# Altium project BLDC_INDY_2024.PrjPcb
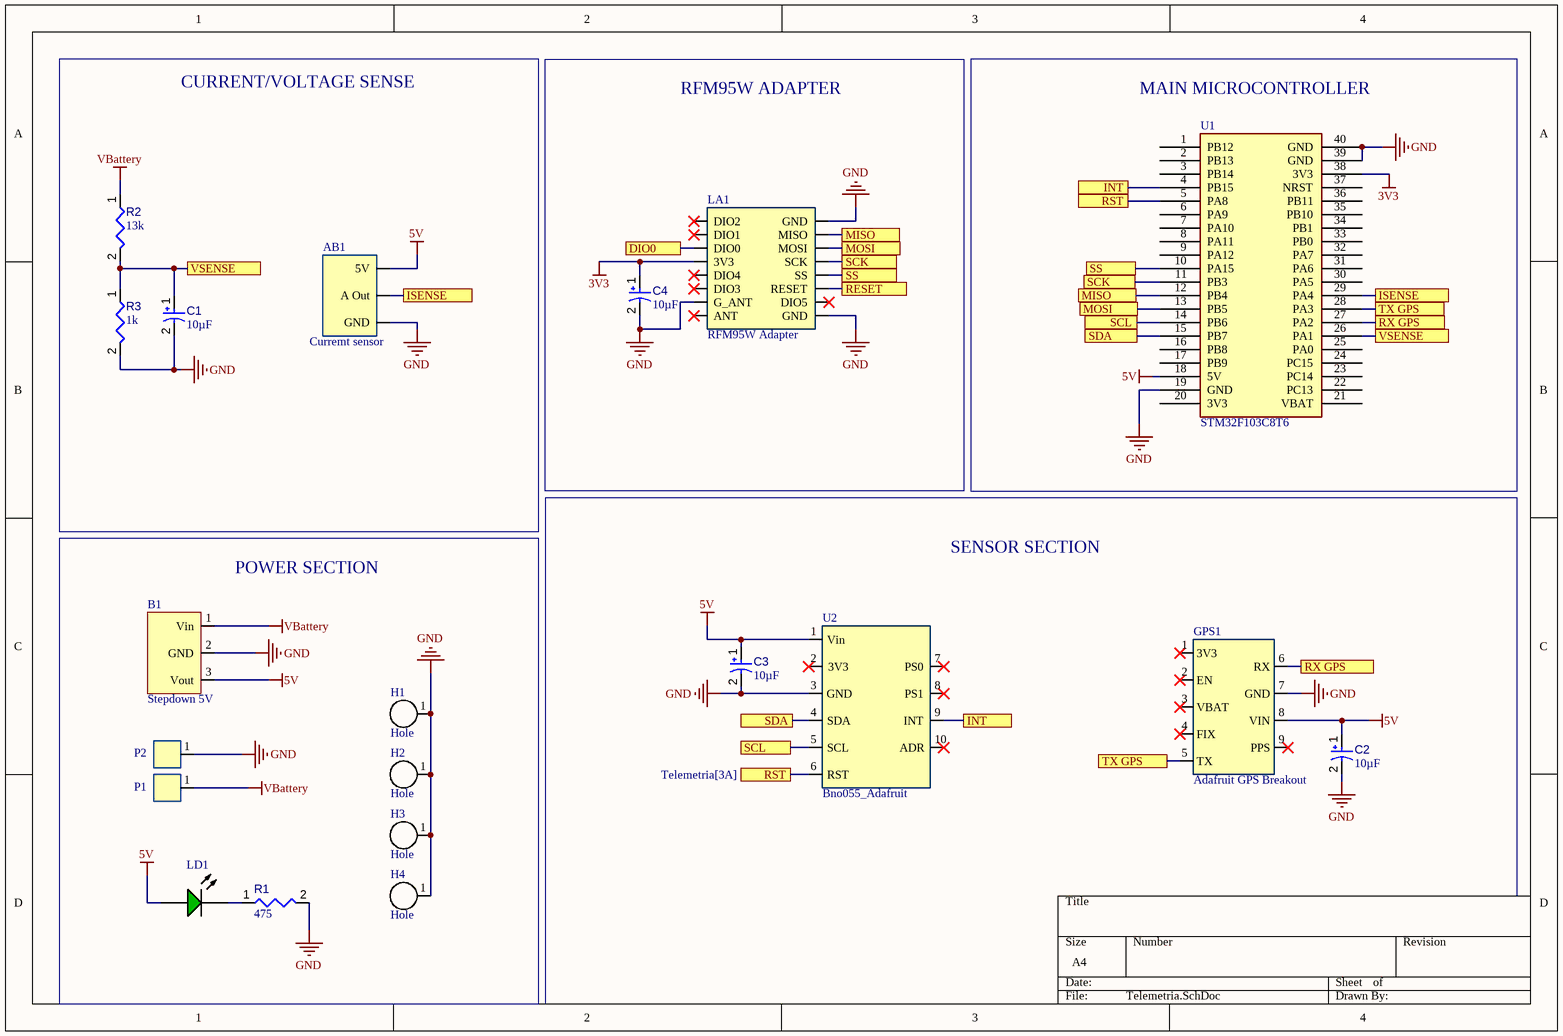
[diagram p0: Telemetria.SchDoc]
1 sheet, 20 parts. Net scope: flat (ports and power ports of the same name join across sheets).
Board file: Telemetria2.PcbDoc

## Sheet Telemetria.SchDoc: BLDC Controller
size A4; Engineer: Elyos; SheetNumber: 1; SheetTotal: 1

### Parts
AB1  Curremt sensor  [ACS712 Board]
B1  Stepdown 5V  [StepDown 5V]
C1  value 10µF  [CAPPR55-200-1100X500X1200]  (hidden comment: ECA1HM100)
C2  value 10µF  [CAPPR55-200-1100X500X1200]  (hidden comment: ECA1HM100)
C3  value 10µF  [CAPPR55-200-1100X500X1200]  (hidden comment: ECA1HM100)
C4  value 10µF  [CAPPR55-200-1100X500X1200]  (hidden comment: ECA1HM100)
GPS1  Adafruit GPS Breakout  [Adafruit GPS breakout]
H1  Hole  [Hole]
H2  Hole  [Hole]
H3  Hole  [Hole]
H4  Hole  [Hole]
LA1  RFM95W Adapter  [Lora Adapter]
LD1  304090040  [LED-2P-2.28-3MM]  (value not drawn)
P1  High power pad  [HIGH_POWER_PAD]  (value not drawn)
P2  High power pad  [HIGH_POWER_PAD]  (value not drawn)
R1  value 475  [RESA60-630X240]  (hidden comment: MFR-25FBF52-475R)
R2  value 13k  [RESA60-630X240]  (hidden comment: MFR-25FBF52-1K)
R3  value 1k  [RESA60-630X240]  (hidden comment: MFR-25FBF52-1K)
U1  STM32F103C8T6  [Stm32 BluePill]
U2  Bno055_Adafruit  [Bno055_Adafruit]

### Ports
DIO0, INT (see Telemetria[3A]), INT (see Telemetria[3C]), ISENSE (see Telemetria[2B]), ISENSE (see Telemetria[4B]), MISO (see Telemetria[3A]), MISO (see Telemetria[3B]), MOSI (see Telemetria[3A]), MOSI (see Telemetria[3B]), RESET, RST (see Telemetria[2D]), RST (see Telemetria[3A]), RX GPS (see Telemetria[4B]), RX GPS (see Telemetria[4C]), SCK (see Telemetria[3B]), SCL (see Telemetria[2C]), SCL (see Telemetria[3B]), SDA (see Telemetria[2C]), SDA (see Telemetria[3B]), SS (see Telemetria[3B]), TX GPS (see Telemetria[3C]), TX GPS (see Telemetria[4B]), VSENSE (see Telemetria[1B]), VSENSE (see Telemetria[4B])

### Nets
3V3: C4.1 LA1.4(3V3) U1.38(3V3)
5V: AB1.3(5V) B1.3(Vout) C2.1 C3.1 GPS1.8(VIN) LD1.1(A) U1.18(5V) U2.1(Vin)
GND: AB1.1(GND) B1.2(GND) C1.2 C2.2 C3.2 C4.2 GPS1.7(GND) H1.1(GND) H2.1(GND) H3.1(GND) H4.1(GND) LA1.7(G_ANT) LA1.9(GND) LA1.16(GND) P2.1(PAD) R1.2 R3.2 U1.19(GND) U1.39(GND) U1.40(GND) U2.3(GND)
VBattery: B1.1(Vin) P1.1(PAD) R2.1
NetAB1_2: AB1.2(A_Out) U1.29(PA4) ; port ISENSE
NetC1_1: C1.1 R2.2 R3.1 U1.26(PA1) ; port VSENSE
NetGPS1_5: GPS1.5(TX) U1.28(PA3) ; port TX GPS
NetGPS1_6: GPS1.6(RX) U1.27(PA2) ; port RX GPS
NetLA1_3: LA1.3(DIO0) ; port DIO0
NetLA1_10: LA1.10(MISO) U1.12(PB4) ; port MISO
NetLA1_11: LA1.11(MOSI) U1.13(PB5) ; port MOSI
NetLA1_12: LA1.12(SCK) U1.11(PB3) ; port SCK
NetLA1_13: LA1.13(SS) U1.10(PA15) ; port SS
NetLA1_14: LA1.14(RESET) ; port RESET
NetLD1_2: LD1.2(K) R1.1
NetU1_4: U1.4(PB15) U2.9(INT) ; port INT
NetU1_5: U1.5(PA8) U2.6(RST) ; port RST
NetU1_14: U1.14(PB6) U2.5(SCL) ; port SCL
NetU1_15: U1.15(PB7) U2.4(SDA) ; port SDA

Not connected (* = marked no-connect by the designer): GPS1 1(3V3)* 2(EN)* 3(VBAT)* 4(FIX)* 9(PPS)*; LA1 1(DIO2)* 2(DIO1)* 5(DIO4)* 6(DIO3)* 8(ANT)* 15(DIO5)*; U1 1(PB12) 2(PB13) 3(PB14) 6(PA9) 7(PA10) 8(PA11) 9(PA12) 16(PB8) 17(PB9) 20(3V3) 21(VBAT) 22(PC13) 23(PC14) 24(PC15) 25(PA0) 30(PA5) 31(PA6) 32(PA7) 33(PB0) 34(PB1) 35(PB10) 36(PB11) 37(NRST); U2 2(3V3)* 7(PS0)* 8(PS1)* 10(ADR)*

### Notes on the sheet
- CURRENT/VOLTAGE SENSE
- RFM95W ADAPTER
- (near U1) MAIN MICROCONTROLLER
- POWER SECTION
- SENSOR SECTION

### Library data of the parts
AB1 = ACS712 Board: ACS712 HAll effect based current sensor
B1 = Stepdown 5V: Buck converter DC-DC 5v Mornsun - K78U05-500R3
C1-C4 = CMP-001-00025-7: Aluminum Electrolytic Capacitor, 10 uF, +/- 20%, 50 V, -40 to 85 degC, 2-Pin THD, RoHS, Bulk; Manufacturer: Panasonic; Ripple Current (AC): 65mA; Voltage Rating: 50V; Mounting Technology: TH; RoHS Compliant: True; Capacitor Type: Electrolytic; Datasheet Version: Rev. 05, 10/2016; Min Operating Temperature: -40°C; Packaging: Bulk; Ripple Current: 65mA; Tolerance: 20%; Max Operating Temperature: 85°C; Datasheet URL: https://industrial.panasonic.com/cdbs/www-data/pdf/RDF0000/ABA0000C1218.pdf; Lead Pitch: 2mm; Pins: 2; Diameter: 5mm; Manufacturer URL: http://www.panasonic.com/; Package Reference: CAPPR55-200-1100X500X1200; Package Description: 2-Pin Radial Lead, Dia 5 mm, Height 12 mm; Case/Package: Radial; Package Quantity: 200
GPS1 = Adafruit GPS: Adafruit GPS Breakout DIP Board
H1-H4 = Hole: Circular hole for attaching PCB
LA1 = Lora Adapter
LD1 = CMP-007-00006-2: Green LED, 80 mW, 20 mA, -25 to 85 degC, 2-Pin THD; Manufacturer: Shenzhen CGX; Manufacturer URL: http://szcgx.com/; Package Reference: 304090040; Datasheet Version: Rev. 1.0, 09/2014; RoHS Compliant: Unknown; Case/Package: 304090040; Package Description: 2-Pin Through Hole Device, Dia 3 mm, Pitch 2.28 mm; Datasheet URL: http://datasheet.octopart.com/304090040-Chengguangxing-datasheet-62330655.pdf; Mounting Technology: TH
P1 P2 = HIGH_POWER_PAD: High power pads (7.5 x 15 mm)
R1 = CMP-009-00056-4: Axial Resistor, 475 Ohm, +/- 1%, 0.25 W, -55 to 155 degC, 2-Pin THD, RoHS, Bulk; Manufacturer: Yageo; Voltage Rating: 250V; Power: 250mW; Case/Package: Axial; Datasheet URL: http://www.yageo.com/documents/recent/Yageo%20LR_MFR_2013.pdf; Tolerance: 1%; RoHS Compliant: True; Mounting Technology: TH; Packaging: Bulk; Package Description: 2-Pin Axial Lead, Dia 2.4 mm, Body Length 6.3 mm; Max Operating Temperature: 155°C; Package Reference: MFR-25; Datasheet Version: Apr-13; Min Operating Temperature: -55°C; Package Quantity: 200; Manufacturer URL: http://www.yageo.com/
R2 R3 = CMP-009-00048-4: Axial Resistor, 1 KOhm, +/- 1%, 250 mW, -55 to 155 degC, 2-Pin THD, RoHS, Bulk; Manufacturer: Yageo; Voltage Rating: 250V; Power: 250mW; Min Operating Temperature: -55°C; Max Operating Temperature: 155°C; Tolerance: 1%; Package Reference: MFR-25; Composition: CarbonFilm; Mounting Technology: TH; Packaging: Bulk; Case/Package: Axial; Datasheet URL: http://www.yageo.com/documents/recent/Yageo%20LR_MFR_2013.pdf; Package Quantity: 200; Manufacturer URL: http://www.yageo.com/; Package Description: 2-Pin Axial Lead, Dia 2.4 mm, Body Length 6.3 mm; Datasheet Version: Apr-13; RoHS Compliant: True
U1 = BluePill: Designed By @Alixahedi
U2 = Bno055_Adafruit: Adafruit IMU breakout part 2472 based on Bosch BNO055 IC